# Altium schematic sheet SCH_POWER.SchDoc
size A3; SheetNumber: 8; SheetTotal: 10
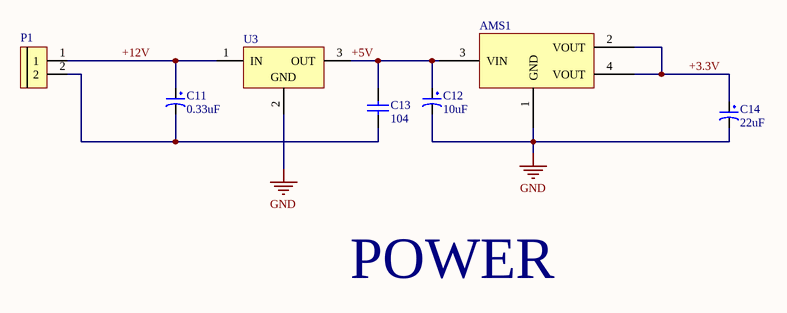
[diagram p0: SCH_POWER.SchDoc]

## Parts
AMS1  (no value)  [SOT223]
C11  0.33uF  [tu hoa 5mm]
C12  10uF  [tu hoa 13mm]
C13  104  [tu 1206]
C14  22uF  [tu hoa 4mm]
P1  (no value)  [CON 2 2EDG5.08]
U3  (no value)  [TO252]

## Nets
GND: AMS1.1(GND) C12.2 C14.2 U3.2(GND)
+3.3V: AMS1.2(VOUT) AMS1.4(VOUT) C14.1
+5V: AMS1.3(VIN) C12.1 C13.1 U3.3(OUT)
+12V: C11.1 P1.1 U3.1(IN)
NetC11_2: C11.2 C13.2 P1.2

## Notes on the sheet
- POWER

## Library data of the parts
AMS1 = AMS1117 SMD: Dán; Value: AMS1117-3.3V SOT223; Don_Vi: Con; Ma_Hang: MH000596; Ghi_Chu: *; Kieu_Chan: *; Chung_Loai: Dán
C11 = Tu Hoa 0.33uF 50V 5x11: Cắm; Don_Vi: Con; So_Chan: 2; Ten_Linh_Kien: Tụ Hóa 0.33uF 50V 5x11MM; Ma_Hang: MH004655; Chung_Loai: Cắm; Kieu_Chan: *
C12 = Tu Hoa 10uF 450V 13x20: Cắm; Don_Vi: Con; So_Chan: 2; Ten_Linh_Kien: Tụ Hóa 10uF 450V 13x20MM; Ma_Hang: MH003950; Chung_Loai: Cắm; Kieu_Chan: *
C13 = Tu 1206 104 50V 20%: Dán; Don_Vi: Con; So_Chan: 2; Ten_Linh_Kien: Tụ 1206 104-0.1uF 20% 50V; Ma_Hang: MH004544; Chung_Loai: Dán; Kieu_Chan: *
C14 = Tu Hoa 22uF 16V 4x7: Cắm; Don_Vi: Con; So_Chan: 2; Ten_Linh_Kien: Tụ Hóa 22uF 16V; Ma_Hang: MH006857; Chung_Loai: Cắm; Kieu_Chan: *
P1 = CON 2 EDG5.08: Cắm; Ten_Linh_Kien: CON 2 2EDG5.08-2P 5.08MM ( Xanh Cong); Don_Vi: Con; Ma_Hang: MH000759; Ghi_Chu: *; Kieu_Chan: *; Chung_Loai: Cắm
U3 = 78M05 SMD TO252: Dán; Don_Vi: Con; Ten_Linh_Kien: 78M05 TO252; Ma_Hang: MH001917; Ghi_Chu: *; Kieu_Chan: *; Chung_Loai: Dán